# EAGLE design EnetJTAGv0a (EAGLE 5.07)
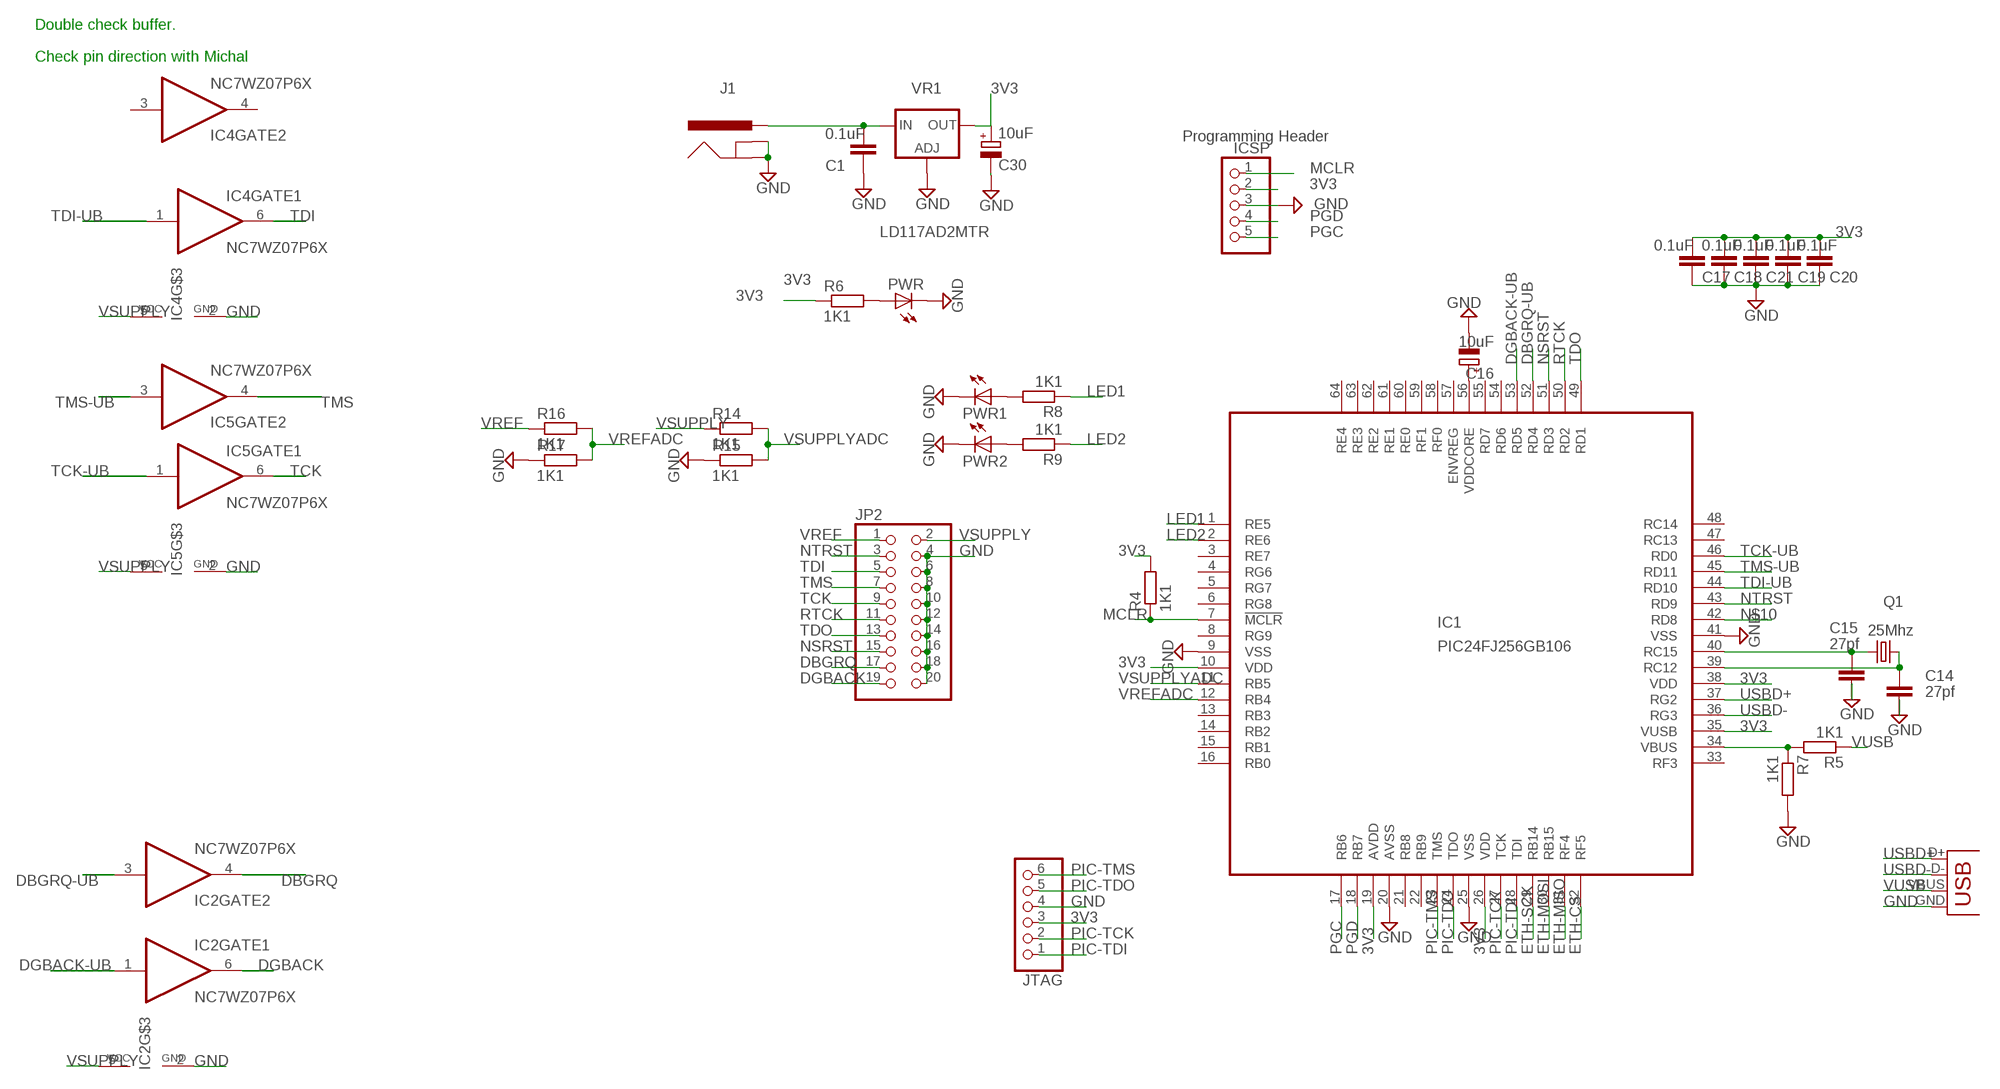
[diagram p0: schematic, sheet 1, part 1 of 2]
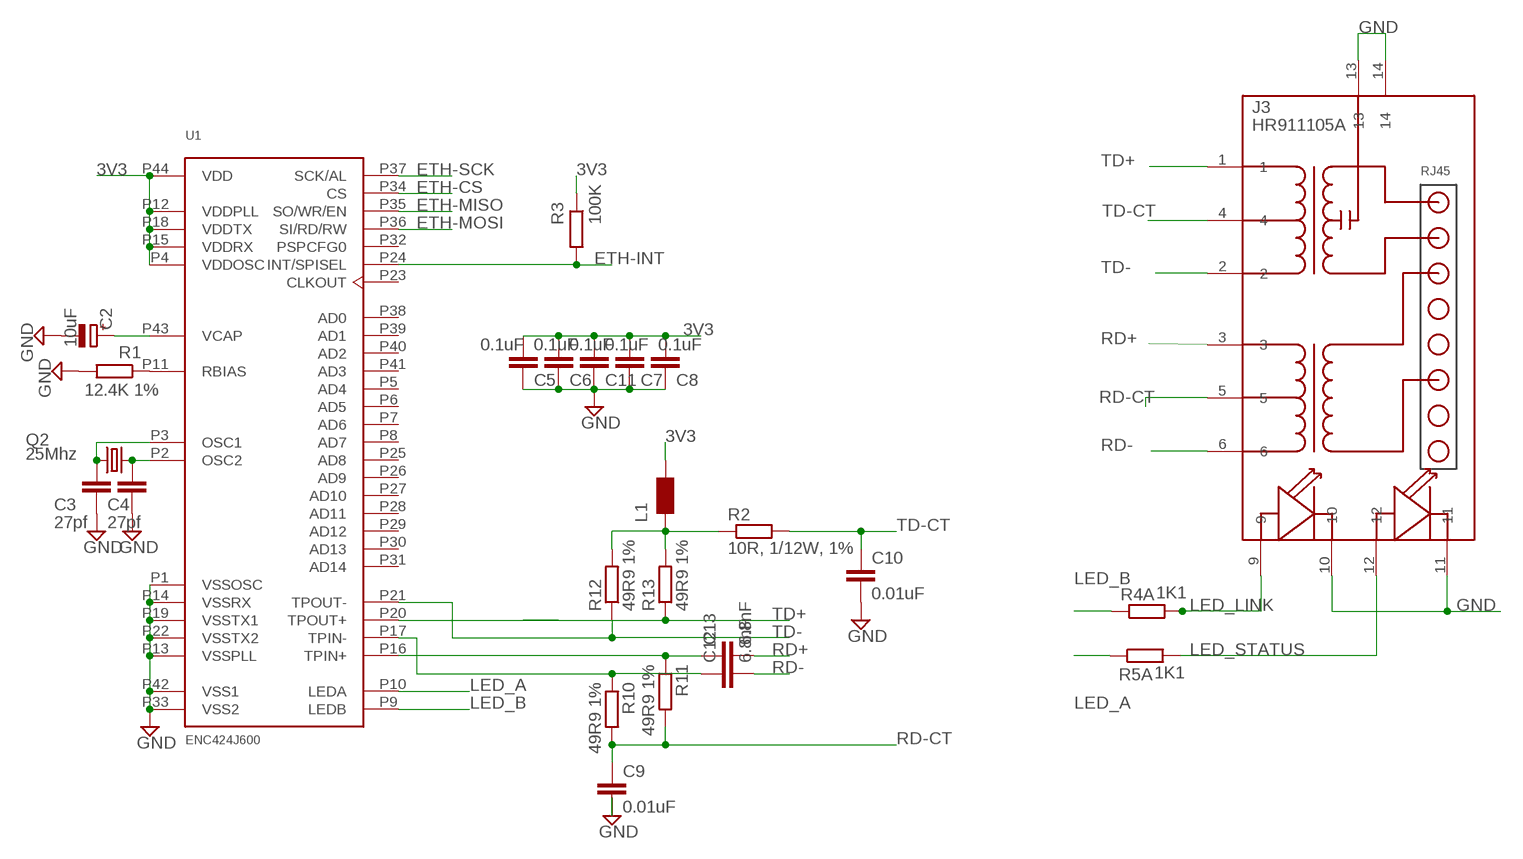
[diagram p1: schematic, sheet 1, part 2 of 2]

## Parts
C1  0.1uF  C-EUC0603  [C0603]
C2  10uF  CPOL-EUSMCA  [SMC_A]
C3  27pf  C-EUC0603  [C0603]
C4  27pf  C-EUC0603  [C0603]
C5  0.1uF  C-EUC0603  [C0603]
C6  0.1uF  C-EUC0603  [C0603]
C7  0.1uF  C-EUC0603  [C0603]
C8  0.1uF  C-EUC0603  [C0603]
C9  0.01uF  C-EUC0603  [C0603]
C10  0.01uF  C-EUC0603  [C0603]
C11  0.1uF  C-EUC0603  [C0603]
C12  6.8nF  C-EUC0603  [C0603]
C13  6.8nF  C-EUC0603  [C0603]
C14  27pf  C-EUC0603  [C0603]
C15  27pf  C-EUC0603  [C0603]
C16  10uF  CPOL-EUSMCA  [SMC_A]
C17  0.1uF  C-EUC0603  [C0603]
C18  0.1uF  C-EUC0603  [C0603]
C19  0.1uF  C-EUC0603  [C0603]
C20  0.1uF  C-EUC0603  [C0603]
C21  0.1uF  C-EUC0603  [C0603]
C30  10uF  CPOL-EUSMCA  [SMC_A]
IC1  PIC24FJ256GB106  [TQFP64-10X10]
IC2  NC7WZ07P6X  [SC70-6]
IC4  NC7WZ07P6X  [SC70-6]
IC5  NC7WZ07P6X  [SC70-6]
ICSP  PINHD-1X5  [1X05]
J1  POWER_JACKSMD  [POWER_JACK_SMD]
J3  HR911105A  [HR911105A]
JP2  PINHD-2X10  [2X10]
JTAG  PINHD-1X6  [1X06]
L1  WE-KIL_0805  [WE-KI_0805_B]
PWR  LEDCHIPLED_0603  [CHIPLED_0603]
PWR1  LEDCHIPLED_0603  [CHIPLED_0603]
PWR2  LEDCHIPLED_0603  [CHIPLED_0603]
Q1  25Mhz  CRYSTALHC49UP  [HC49UP]
Q2  25Mhz  CRYSTALHC49UP  [HC49UP]
R1  12.4K 1%  R-EU_R0603  [R0603]
R2  10R, 1/12W, 1%  R-EU_R0603  [R0603]
R3  100K  R-EU_R0603  [R0603]
R4  1K1  R-EU_R0603  [R0603]
R4A  1K1  R-EU_R0603  [R0603]
R5  1K1  R-EU_R0603  [R0603]
R5A  1K1  R-EU_R0603  [R0603]
R6  1K1  R-EU_R0603  [R0603]
R7  1K1  R-EU_R0603  [R0603]
R8  1K1  R-EU_R0603  [R0603]
R9  1K1  R-EU_R0603  [R0603]
R10  49R9 1%  R-EU_R0603  [R0603]
R11  49R9 1%  R-EU_R0603  [R0603]
R12  49R9 1%  R-EU_R0603  [R0603]
R13  49R9 1%  R-EU_R0603  [R0603]
R14  1K1  R-EU_R0603  [R0603]
R15  1K1  R-EU_R0603  [R0603]
R16  1K1  R-EU_R0603  [R0603]
R17  1K1  R-EU_R0603  [R0603]
U1  ENC424J600  [TQFP44]
VR1  LD117AD2MTR  [D2PACK]
X2  USBSMD  [USB-MINIB]

## Nets
3V3: C5.1 C6.1 C7.1 C8.1 C11.1 C17.1 C18.1 C19.1 C20.1 C21.1 C30.+ IC1.10(VDD) IC1.19(AVDD) IC1.26(VDD) IC1.35(VUSB) IC1.38(VDD) ICSP.2 JTAG.3 L1.1 R3.1 R4.2 R6.1 U1.P4(VDDOSC) U1.P12(VDDPLL) U1.P15(VDDRX) U1.P18(VDDTX) U1.P44(VDD) VR1.2(OUT)
CCT: L1.2 R2.1 R12.2 R13.2
DBGRQ: IC2.4(GATE2:O) JP2.17
DBGRQ-UB: IC1.52(RD4) IC2.3(GATE2:I)
DGBACK: IC2.6(GATE1:O) JP2.19
DGBACK-UB: IC1.53(RD5) IC2.1(GATE1:I)
DSFGDF: C12.1 R10.1 U1.P17(TPIN-)
DSGDFSG: C13.1 R11.1 U1.P16(TPIN+)
ETH-CS: IC1.32(RF5) U1.P34(CS)
ETH-INT: R3.2 U1.P24(INT/SPISEL)
ETH-MISO: IC1.31(RF4) U1.P35(SO/WR/EN)
ETH-MOSI: IC1.30(RB15) U1.P36(SI/RD/RW)
ETH-SCK: IC1.29(RB14) U1.P37(SCK/AL)
GND: C1.2 C2.- C3.2 C4.2 C5.2 C6.2 C7.2 C8.2 C9.2 C10.2 C11.2 C14.2 C15.2 C16.- C17.2 C18.2 C19.2 C20.2 C21.2 C30.- IC1.9(VSS) IC1.20(AVSS) IC1.25(VSS) IC1.41(VSS) IC2.2(GND) IC4.2(GND) IC5.2(GND) ICSP.3 J1.GND(GNDBREAK) J1.P$4(GND) J3.10 J3.11 J3.13 J3.14 JP2.4 JP2.6 JP2.8 JP2.10 JP2.12 JP2.14 JP2.16 JP2.18 JP2.20 JTAG.4 PWR1.C PWR2.C PWR.C R1.2 R7.2 R15.1 R17.1 U1.P1(VSSOSC) U1.P13(VSSPLL) U1.P14(VSSRX) U1.P19(VSSTX1) U1.P22(VSSTX2) U1.P33(VSS2) U1.P42(VSS1) VR1.1(ADJ) X2.GND
LED1: IC1.1(RE5) R8.1
LED2: IC1.2(RE6) R9.1
LED_A: R5A.1 U1.P10(LEDA)
LED_B: R4A.1 U1.P9(LEDB)
LED_LINK: J3.9 R4A.2
LED_STATUS: J3.12 R5A.2
MCLR: IC1.7(!MCLR) ICSP.1 R4.1
N$1: C2.+ U1.P43(VCAP)
N$2: R1.1 U1.P11(RBIAS)
N$3: C15.1 IC1.40(RC15) Q1.1
N$4: C3.1 Q2.1 U1.P3(OSC1)
N$5: C14.1 IC1.39(RC12) Q1.2
N$6: PWR1.A R8.2
N$7: PWR2.A R9.2
N$8: C4.1 Q2.2 U1.P2(OSC2)
N$9: C16.+ IC1.56(VDDCORE)
N$10: IC1.42(RD8)
N$11: IC1.34(VBUS) R5.2 R7.1
N$29: PWR.A R6.2
NSRST: IC1.51(RD3) JP2.15
NTRST: IC1.43(RD9) JP2.3
PGC: IC1.17(RB6) ICSP.5
PGD: IC1.18(RB7) ICSP.4
PIC-TCK: IC1.27(TCK) JTAG.2
PIC-TDI: IC1.28(TDI) JTAG.1
PIC-TDO: IC1.24(TDO) JTAG.5
PIC-TMS: IC1.23(TMS) JTAG.6
RD+: C13.2 J3.3
RD-: C12.2 J3.6
RD-CT: C9.1 J3.5 R10.2 R11.2
RTCK: IC1.50(RD2) JP2.11
TCK: IC5.6(GATE1:O) JP2.9
TCK-UB: IC1.46(RD0) IC5.1(GATE1:I)
TD+: J3.1 R13.1 U1.P20(TPOUT+)
TD-: J3.2 R12.1 U1.P21(TPOUT-)
TD-CT: C10.1 J3.4 R2.2
TDI: IC4.6(GATE1:O) JP2.5
TDI-UB: IC1.44(RD10) IC4.1(GATE1:I)
TDO: IC1.49(RD1) JP2.13
TMS: IC5.4(GATE2:O) JP2.7
TMS-UB: IC1.45(RD11) IC5.3(GATE2:I)
USBD+: IC1.37(RG2) X2.D+
USBD-: IC1.36(RG3) X2.D-
VBAT: C1.1 J1.VIN0(PWR) VR1.3(IN)
VREF: JP2.1 R16.1
VREFADC: IC1.12(RB4) R16.2 R17.2
VSUPPLY: IC2.5(VCC) IC4.5(VCC) IC5.5(VCC) JP2.2 R14.1
VSUPPLYADC: IC1.11(RB5) R14.2 R15.2
VUSB: R5.1 X2.VBUS
Unconnected: IC1.3(RE7) IC1.4(RG6) IC1.5(RG7) IC1.6(RG8) IC1.8(RG9) IC1.13(RB3) IC1.14(RB2) IC1.15(RB1) IC1.16(RB0) IC1.21(RB8) IC1.22(RB9) IC1.33(RF3) IC1.47(RC13) IC1.48(RC14) IC1.54(RD6) IC1.55(RD7) IC1.57(ENVREG) IC1.58(RF0) IC1.59(RF1) IC1.60(RE0) IC1.61(RE1) IC1.62(RE2) IC1.63(RE3) IC1.64(RE4) IC4.3(GATE2:I) IC4.4(GATE2:O) U1.P5(AD4) U1.P6(AD5) U1.P7(AD6) U1.P8(AD7) U1.P23(CLKOUT) U1.P25(AD8) U1.P26(AD9) U1.P27(AD10) U1.P28(AD11) U1.P29(AD12) U1.P30(AD13) U1.P31(AD14) U1.P32(PSPCFG0) U1.P38(AD0) U1.P39(AD1) U1.P40(AD2) U1.P41(AD3)

## Notes on the sheet
- Double check buffer.
- Check pin direction with Michal
- J1
- Programming Header

## Library data of the parts
C1 C3-C15 C17-C21 = rcl:C-EU: CAPACITOR, European symbol
C2 C16 C30 = rcl:CPOL-EU: POLARIZED CAPACITOR, European symbol
IC1 = microchip:PIC24FJ256GB106: PIC24FJ256GB106 edit this description Auto generated by make-symbol-device-package-bsdl.ulp Rev. 25 Source: PIC24FJ256GB106.bsd
IC2 IC4 IC5 = GadgetFactory:NC7WZ07P6X: Dual line drivers with 3-state outputs.
ICSP = pinhead-2:PINHD-1X5: PIN HEADER
J1 = SparkFun:POWER_JACK: Power Jack This is the standard 5.5mm barrel jack for power. The PTH is the most common, proven, reliable, footprint. All others are experimental. The Slot footprint only works if the mill layer is transmitted to the PCB fab house so be warned. Spark Fun Electronics SKU : PRT-00119. Mating wall wart : TOL-00298 (and others)
J3 = CONNECTER:HR911105A
JP2 = pinhead-2:PINHD-2X10: PIN HEADER
JTAG = pinhead-2:PINHD-1X6: PIN HEADER
L1 = wuerth-elektronik:WE-KIL: SMD Wire Wound Ceramic Inductor WE-KIL - Low profile - High Q values -- Bluetooth -- Wireless LAN -- RF oscillation circuit -- IF impedance matching
PWR PWR1 PWR2 = led:LED: LED OSRAM: - CHIPLED LG R971, LG N971, LY N971, LG Q971, LY Q971, LO R971, LY R971 LH N974, LH R974 LS Q976, LO Q976, LY Q976 LO Q996 - Hyper CHIPLED LW Q18S LB Q993, LB Q99A, LB R99A - SideLED LS A670, LO A670, LY A670, LG A670, LP A670 LB A673, LV A673, LT A673, LW A673 LH A674 LY A675 LS A676, LA A676, LO A676, LY A676, LW A676 LS A679, LY A679, LG A679 - Hyper Micro SIDELED® LS Y876, LA Y876, LO Y876, LY Y876 LT Y87S - SmartLED LW L88C, LW L88S LB L89C, LB L89S, LG L890 LS L89K, LO L89K, LY L89K LS L896, LA L896, LO L896, LY L896 - TOPLED LS T670, LO T670, LY T670, LG T670, LP T670 LSG T670, LSP T670, LSY T670, LOP T670, LYG T670 LG T671, LOG T671, LSG T671 LB T673, LV T673, LT T673, LW T673 LH T674 LS T676, LA T676, LO T676, LY T676, LB T676, LH T676, LSB T676, LW T676 LB T67C, LV T67C, LT T67C, LS T67K, LO T67K, LY T67K, LW E67C LS E67B, LA E67B, LO E67B, LY E67B, LB E67C, LV E67C, LT E67C LW T67C LS T679, LY T679, LG T679 LS T770, LO T770, LY T770, LG T770, LP T770 LB T773, LV T773, LT T773, LW T773 LH T774 LS E675, LA E675, LY E675, LS T675 LS T776, LA T776, LO T776, LY T776, LB T776 LHGB T686 LT T68C, LB T68C - Hyper Mini TOPLED® LB M676 - Mini TOPLED Santana® LG M470 LS M47K, LO M47K, LY M47K Source: http://www.osram.convergy.de LUXEON: - LUMILED® LXK2-PW12-R00, LXK2-PW12-S00, LXK2-PW14-U00, LXK2-PW14-V00 LXK2-PM12-R00, LXK2-PM12-S00, LXK2-PM14-U00 LXK2-PE12-Q00, LXK2-PE12-R00, LXK2-PE12-S00, LXK2-PE14-T00, LXK2-PE14-U00 LXK2-PB12-K00, LXK2-PB12-L00, LXK2-PB12-M00, LXK2-PB14-N00, LXK2-PB14-P00, LXK2-PB14-Q00 LXK2-PR12-L00, LXK2-PR12-M00, LXK2-PR14-Q00, LXK2-PR14-R00 LXK2-PD12-Q00, LXK2-PD12-R00, LXK2-PD12-S00 LXK2-PH12-R00, LXK2-PH12-S00 LXK2-PL12-P00, LXK2-PL12-Q00, LXK2-PL12-R00 Source: www.luxeon.com KINGBRIGHT: KA-3528ASYC Source: www.kingbright.com
Q1 Q2 = crystal:CRYSTAL: CRYSTAL
R1-R4 R4A R5 R5A R6-R17 = rcl:R-EU_: RESISTOR, European symbol
U1 = dp_devices:ENC424J600: Stand-Alone 10/100 Ethernet Controller with SPI or Parallel Interface Source: http://ww1.microchip.com/downloads/en/DeviceDoc/39935c.pdf
VR1 = v-reg:LD117A?*: Low drop fixed and adjustable positive voltage regulators 1 A Source: http://www.st.com/stonline/products/literature/ds/7194/ld1117axx.pdf
X2 = SparkFun:USB: USB Connectors USB-B-PTH is fully proven SKU : PRT-00139 USB-miniB is fully proven SKU : PRT-00587 USB-A-PCB is untested. USB-A-H is throughly reviewed, but untested. Spark Fun Electronics SKU : PRT-00437 USB-B-SMT is throughly reviewed, but untested. Needs silkscreen touching up. USB-A-S has not been used/tested USB-MB-H has not been used/tested

## Board
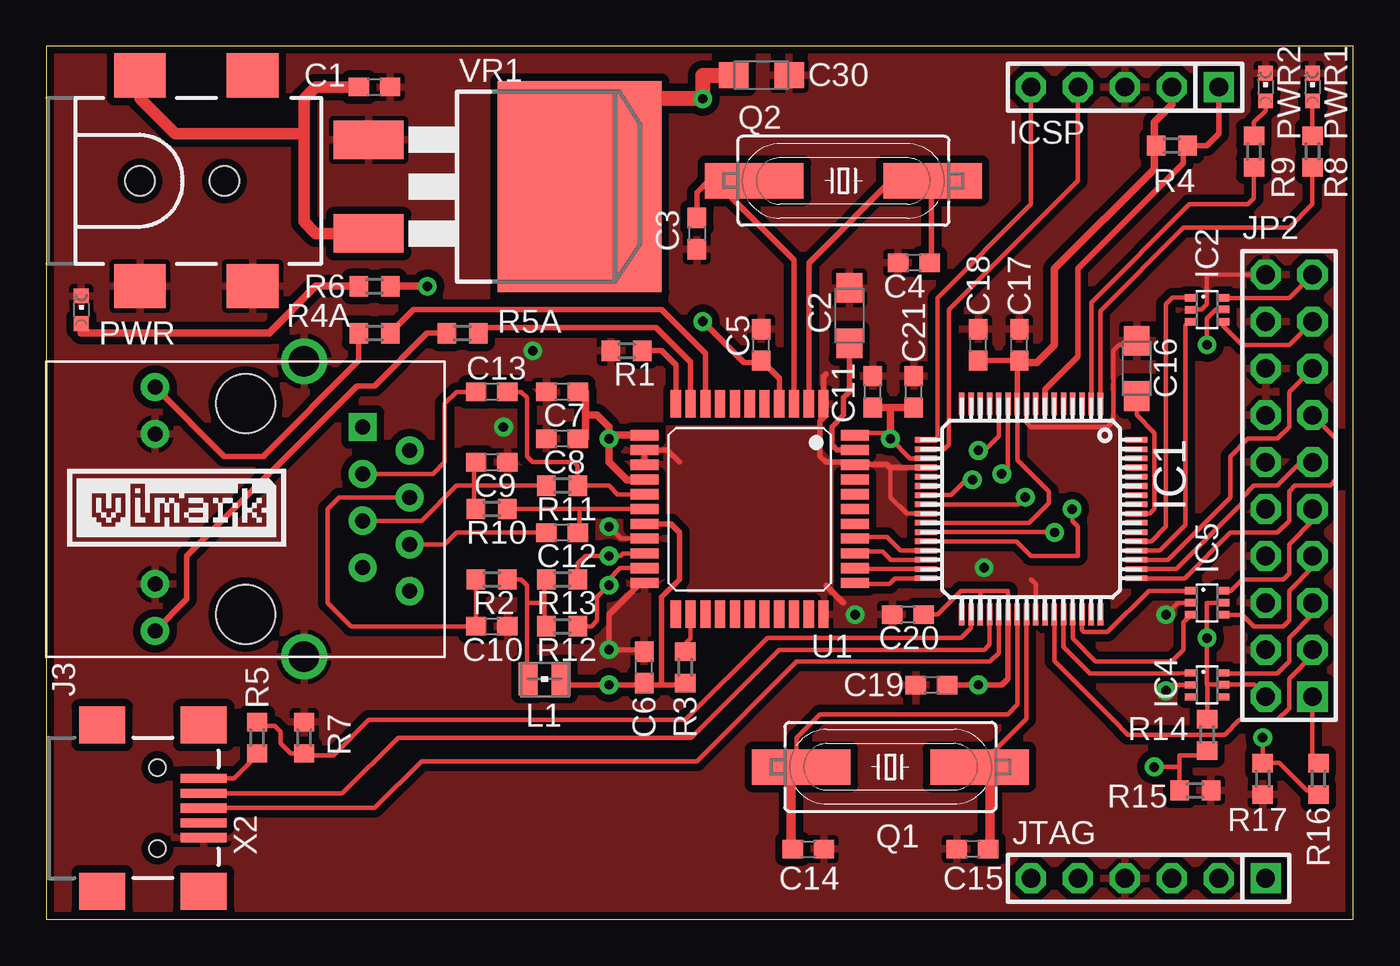
[diagram p2: board, top side]
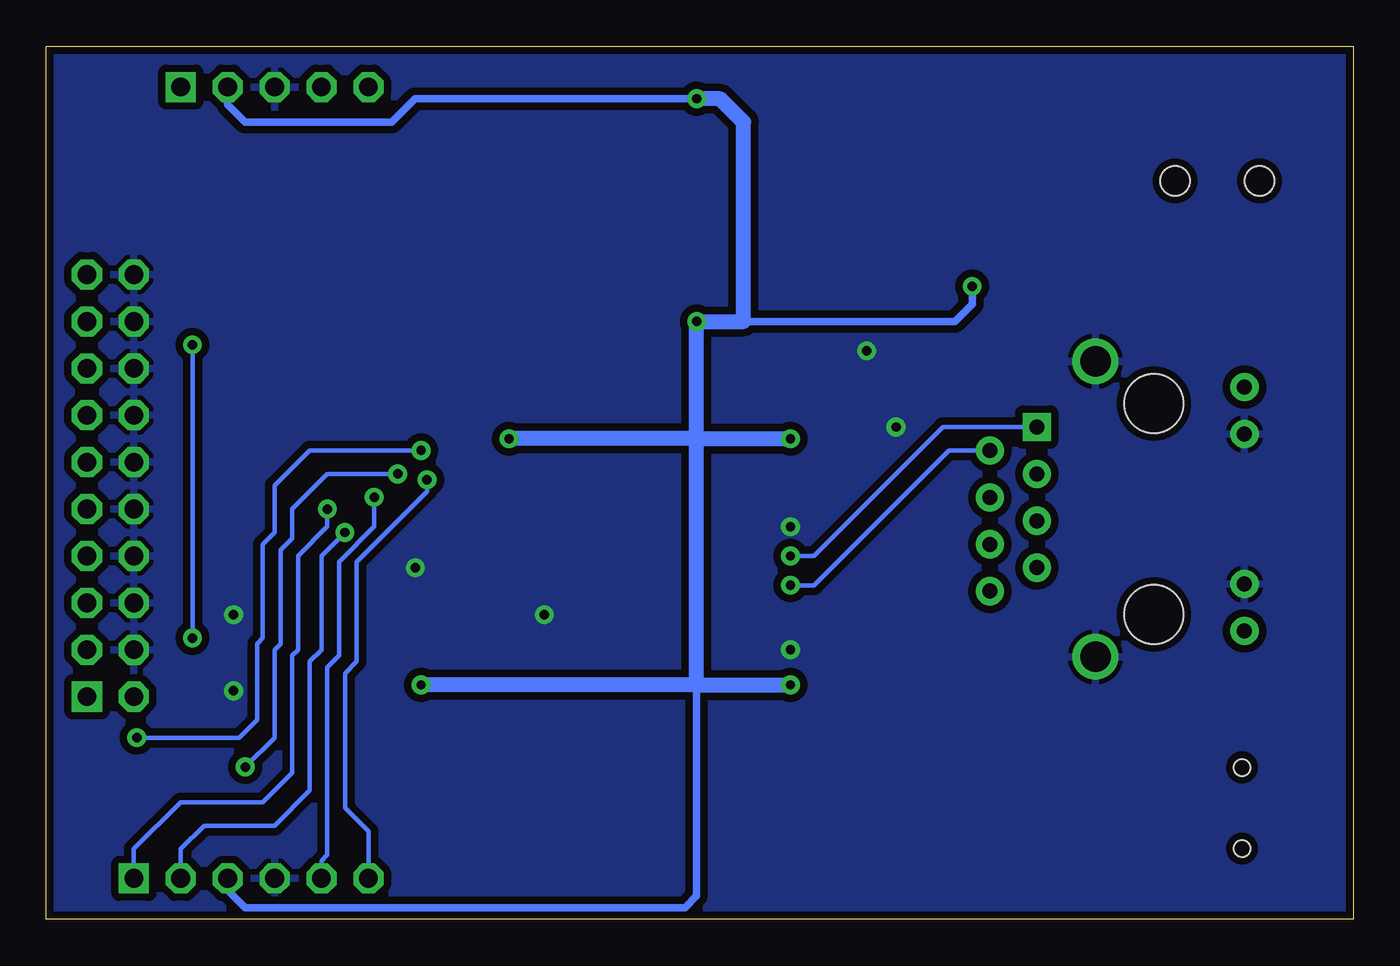
[diagram p3: board, bottom side, seen from below]

Size 70.79 x 47.3 mm. Coordinates in mm from the lower left corner, seen from the top.
Outline: 0,0 70.79,0 70.79,47.3 0,47.3 0,0
Copper layers (1*16): Top 0.035mm / dielectric 1.5mm / Bottom 0.035mm
Design rules "SparkFun": minimum track width 8mil, minimum drill 20mil, track to track 8mil, track to pad 8mil, pad to pad 8mil, via to via 8mil, smd to smd 8mil, copper to edge 10mil, drill to drill 8mil, minimum pad ring 12mil, minimum via ring 10mil, stop-mask expansion 4mil, vias tented up to drill 25mil, thermal gap 10mil

### Footprints (pad centres in the part's own frame; a part is rotated, then mirrored left to right if it is on the bottom)
C0603 = smd 1.1 x 1: 1 -0.85,0; 2 0.85,0
SMC_A = smd 1.6 x 1.4: + -1.5,0; - 1.5,0
TQFP64-10X10 = smd 1.2 x 0.3: 1 -5.7,3.75; 2 -5.7,3.25; 3 -5.7,2.75; 4 -5.7,2.25; 5 -5.7,1.75; 6 -5.7,1.25; 7 -5.7,0.75; 8 -5.7,0.25; 9 -5.7,-0.25; 10 -5.7,-0.75; 11 -5.7,-1.25; 12 -5.7,-1.75; 13 -5.7,-2.25; 14 -5.7,-2.75; 15 -5.7,-3.25; 16 -5.7,-3.75; 33 5.7,-3.75; 34 5.7,-3.25; 35 5.7,-2.75; 36 5.7,-2.25; 37 5.7,-1.75; 38 5.7,-1.25; 39 5.7,-0.75; 40 5.7,-0.25; 41 5.7,0.25; 42 5.7,0.75; 43 5.7,1.25; 44 5.7,1.75; 45 5.7,2.25; 46 5.7,2.75; 47 5.7,3.25; 48 5.7,3.75 | smd 0.3 x 1.2: 17 -3.75,-5.7; 18 -3.25,-5.7; 19 -2.75,-5.7; 20 -2.25,-5.7; 21 -1.75,-5.7; 22 -1.25,-5.7; 23 -0.75,-5.7; 24 -0.25,-5.7; 25 0.25,-5.7; 26 0.75,-5.7; 27 1.25,-5.7; 28 1.75,-5.7; 29 2.25,-5.7; 30 2.75,-5.7; 31 3.25,-5.7; 32 3.75,-5.7; 49 3.75,5.7; 50 3.25,5.7; 51 2.75,5.7; 52 2.25,5.7; 53 1.75,5.7; 54 1.25,5.7; 55 0.75,5.7; 56 0.25,5.7; 57 -0.25,5.7; 58 -0.75,5.7; 59 -1.25,5.7; 60 -1.75,5.7; 61 -2.25,5.7; 62 -2.75,5.7; 63 -3.25,5.7; 64 -3.75,5.7
SC70-6 = smd 0.4 x 0.7: 1 -0.65,-0.85; 2 0,-0.85; 3 0.65,-0.85; 4 0.65,0.85; 5 -0.015,0.85; 6 -0.65,0.85
1X05 = drill 1.016 square: 1 -5.08,0 | drill 1.016 octagon: 2 -2.54,0; 3 0,0; 4 2.54,0; 5 5.08,0
POWER_JACK_SMD = smd 2.8 x 2.4: GND 0,-5.7; P$4 6.1,-5.7; VIN0 0,5.7; VIN1 6.1,5.7 | hole 1.6: 0,0; 4.572,0
HR911105A = drill 0.813 pad 1.524 square: 1 4.445,-6.35 | drill 0.813 pad 1.524 round: 2 3.175,-8.89; 3 1.905,-6.35; 4 0.635,-8.89; 5 -0.635,-6.35; 6 -1.905,-8.89; 7 -3.175,-6.35; 8 -4.445,-8.89; 9 6.604,4.902; 10 4.064,4.902; 11 -4.064,4.902; 12 -6.604,4.902 | drill 1.651 pad 2.159 round: 13 8.001,-3.175; 14 -8.001,-3.175 | hole 3.2: 5.715,0; -5.715,0
2X10 = drill 1.016 square: 1 -11.43,-1.27 | drill 1.016 octagon: 2 -11.43,1.27; 3 -8.89,-1.27; 4 -8.89,1.27; 5 -6.35,-1.27; 6 -6.35,1.27; 7 -3.81,-1.27; 8 -3.81,1.27; 9 -1.27,-1.27; 10 -1.27,1.27; 11 1.27,-1.27; 12 1.27,1.27; 13 3.81,-1.27; 14 3.81,1.27; 15 6.35,-1.27; 16 6.35,1.27; 17 8.89,-1.27; 18 8.89,1.27; 19 11.43,-1.27; 20 11.43,1.27
1X06 = drill 1.016 square: 1 -6.35,0 | drill 1.016 octagon: 2 -3.81,0; 3 -1.27,0; 4 1.27,0; 5 3.81,0; 6 6.35,0
WE-KI_0805_B = smd 1.02 x 1.78: 1 -0.89,0; 2 0.89,0
CHIPLED_0603 = smd 0.8 x 0.8: A 0,-0.75; C 0,0.75
HC49UP = smd 5.334 x 1.93: 1 -4.826,0; 2 4.826,0
R0603 = smd 1 x 1.1: 1 -0.85,0; 2 0.85,0
TQFP44 = smd 0.55 x 1.5: P1 -4,-5.7; P2 -3.2,-5.7; P3 -2.4,-5.7; P4 -1.6,-5.7; P5 -0.8,-5.7; P6 0,-5.7; P7 0.8,-5.7; P8 1.6,-5.7; P9 2.4,-5.7; P10 3.2,-5.7; P11 4,-5.7; P23 4,5.7; P24 3.2,5.7; P25 2.4,5.7; P26 1.6,5.7; P27 0.8,5.7; P28 0,5.7; P29 -0.8,5.7; P30 -1.6,5.7; P31 -2.4,5.7; P32 -3.2,5.7; P33 -4,5.7 | smd 1.5 x 0.55: P12 5.7,-4; P13 5.7,-3.2; P14 5.7,-2.4; P15 5.7,-1.6; P16 5.7,-0.8; P17 5.7,0; P18 5.7,0.8; P19 5.7,1.6; P20 5.7,2.4; P21 5.7,3.2; P22 5.7,4; P34 -5.7,4; P35 -5.7,3.2; P36 -5.7,2.4; P37 -5.7,1.6; P38 -5.7,0.8; P39 -5.7,0; P40 -5.7,-0.8; P41 -5.7,-1.6; P42 -5.7,-2.4; P43 -5.7,-3.2; P44 -5.7,-4
D2PACK = smd 2.083 x 3.81: 1 -2.54,-8.89; 3 2.54,-8.89 | smd 11.43 x 8.89: 2 0,2.54
USB-MINIB = smd 2.5 x 0.5: D+ 2.5,0; D- 2.5,0.8; GND 2.5,-1.6; ID 2.5,-0.8; VBUS 2.5,1.6 | smd 2.5 x 2: GND@1 -3,-4.5; GND@2 -3,4.5; GND@3 2.5,4.5; GND@4 2.5,-4.5 | hole 0.9: 0,2.2; 0,-2.2

### Placement (x,y rotation side)
C1  17.78,45.09 0 top
C2  43.5,32.7 90 top
C3  35.24,37.15 270 top
C4  46.99,35.56 180 top
C5  38.73,31.11 90 top
C6  32.38,13.65 90 top
C7  27.94,28.57 180 top
C8  27.94,26.04 180 top
C9  24.13,24.77 0 top
C10  24.13,15.88 0 top
C11  44.77,28.57 90 top
C12  27.94,20.95 180 top
C13  24.13,28.57 180 top
C14  41.27,3.81 0 top
C15  50.16,3.81 180 top
C16  59.05,29.84 90 top
C17  52.7,31.11 90 top
C18  50.48,31.11 90 top
C19  47.94,12.7 180 top
C20  46.67,16.51 180 top
C21  46.99,28.57 90 top
C30  38.73,45.72 0 top
IC1  53.34,22.23 270 top
IC2  62.87,33.02 270 top
IC4  62.87,12.7 270 top
IC5  62.87,17.14 270 top
ICSP  58.42,45.09 180 top
J1  5.08,40.01 0 top
J3  10.79,22.23 90 top
JP2  67.31,23.5 90 top
JTAG  59.69,2.22 180 top
L1  26.99,13.02 180 top
PWR  1.91,33.02 0 top
PWR1  68.58,45.09 0 top
PWR2  66.04,45.09 0 top
Q1  45.72,8.26 180 top
Q2  43.18,40.01 0 top
R1  31.43,30.8 180 top
R2  24.13,18.41 180 top
R3  34.61,13.65 90 top
R4  60.96,41.91 180 top
R4A  17.78,31.75 180 top
R5  11.43,9.84 90 top
R5A  22.54,31.75 180 top
R6  17.78,34.29 180 top
R7  13.97,9.84 90 top
R8  68.58,41.59 90 top
R9  65.41,41.59 90 top
R10  24.13,22.23 180 top
R11  27.94,23.5 180 top
R12  27.94,15.88 180 top
R13  27.94,18.41 180 top
R14  62.87,10 270 top
R15  62.23,6.99 180 top
R16  68.9,7.62 270 top
R17  65.88,7.62 90 top
U1  38.1,22.23 180 top
U$1  [VIMARK_LOGO]  1.27,20.32 0 top
VR1  26.35,39.69 270 top
X2  6.03,6.03 0 top

### Tracks (layer width: path | path; a pad name or v marks a point on that pad's centre or on a via)
3V3  (via drill 0.51)
  Top 0.254: U1.P12 32.39,26.24 | 32.41,21.41 U1.P18 | 29.21,26.04 C8.1 | v30.48,26.04 30.67,26.23 | 32.38,23.8 U1.P15 | C17.1 52.59,30.15 | IC1.19 46.78,24.98 v45.72,26.04 45.4,26.35 44.45,26.35 | IC1.26 53.23,21.48 54.29,22.54 54.29,23.18 52.59,24.88 IC1.10 | IC1.38 52.07,17.78 50.59,17.78 | 50.59,17.78 IC1.35 | 50.59,17.78 49.53,17.78 48.26,16.51 C20.1
  Top 0.305: R3.1 34.82,12.8 34.61,13.02 34.61,12.7 33.34,12.7 | 52.59,30.15 IC1.10 | U1.P4 39.7,29.3 C5.1 38.63,30.16 37.78,30.16 v35.56,32.38 | U1.P44 44.32,26.23 44.45,26.35 | 32.41,21.41 33.83,21.41 34.29,20.95 34.29,18.41 33.34,17.46 33.34,12.7 | L1.1 27.94,12.7 v30.48,12.7 32.38,12.7 | 32.38,12.7 33.34,12.7 | U1.P12 32.28,26.34 | 29.21,28.57 C7.1 | IC1.38 52.09,13.04 51.75,12.7 v50.48,12.7 C19.1 | C17.1 C18.1 | 32.38,12.7 C6.1
  Top 0.406: 29.21,27.3 29.84,27.3 30.48,26.67 v30.48,26.04 30.48,24.77 31.45,23.8 32.38,23.8 | 29.21,27.3 29.21,26.04 | 30.67,26.23 U1.P12 | 52.81,30.16 53.66,30.16 54.61,31.11 54.61,35.24 60.01,40.64 60.01,41.81 | ICSP.2 60.96,44.13 60.01,43.18 60.01,42.01 | 29.21,27.3 29.21,28.57 | v20.64,34.29 R6.1 | 45.72,27.73 C11.1 | 45.72,27.73 C21.1 | v45.72,26.04 45.72,27.73
  Top 0.61: 52.81,30.16 C17.1 | VR1.2 25.4,40.23 | 60.01,41.81 R4.2 60.01,42.01
  Top 0.813: C30.+ 35.56,45.72 v35.56,44.45 29.21,44.45 | 29.21,44.45 25.72,44.45 25.4,44.13 25.4,40.23 | VR1.2 28.89,44.13 29.21,44.45
  Bottom 0.406: 33.02,32.38 21.59,32.38 20.64,33.34 v20.64,34.29 | JTAG.3 60.96,1.59 60.01,0.64 36.2,0.64 35.56,1.27 35.56,12.7 | ICSP.2 60.96,44.13 60.01,43.18 52.07,43.18 50.8,44.45 v35.56,44.45
  Bottom 0.813: v35.56,44.45 34.29,44.45 33.02,43.18 33.02,32.38 v35.56,32.38 35.56,26.04 | 35.56,26.04 v45.72,26.04 | 35.56,12.7 35.56,26.04 | 35.56,12.7 v50.48,12.7 | 35.56,26.04 v30.48,26.04 | 35.56,12.7 v30.48,12.7
CCT
  Top 0.254: R2.1 25.72,18.41 26.04,18.1 26.04,17.14 | 26.99,15.88 R12.2 26.99,15.98 26.99,17.14 | R13.2 26.99,18.41 26.99,17.14 | 26.04,17.14 26.04,13.08 L1.2 | 26.04,17.14 26.99,17.14
DBGRQ
  Top 0.254: JP2.17 67.31,31.11 64.77,31.11 63.72,32.17 IC2.4
DBGRQ-UB
  Top 0.254: IC1.52 60.3,19.98 61.7,21.38 61.7,32.17 61.91,32.38 IC2.3
DGBACK
  Top 0.254: JP2.19 67.31,33.66 63.73,33.66 IC2.6
DGBACK-UB
  Top 0.254: IC2.1 60.98,33.67 60.64,33.34 60.64,21.27 59.84,20.48 IC1.53
DSFGDF
  Top 0.254: R10.1 28.89,22.23 | 28.89,22.23 U1.P17 | 28.89,22.23 28.89,21.06 C12.1
DSGDFSG
  Top 0.254: U1.P16 30.95,23.02 30.48,23.5 R11.1 28.79,24.55 28.57,24.77 26.35,24.77 26.04,25.08 26.04,28.26 25.72,28.57 C13.1
ETH-CS
  Top 0.254: IC1.32 45.97,18.48 45.66,18.16 43.86,18.16 U1.P34
ETH-INT
  Top 0.254: U1.P24 34.9,15.21 34.29,14.61 R3.2
ETH-MISO
  Top 0.254: IC1.31 43.85,18.98 U1.P35
ETH-MOSI
  Top 0.254: IC1.30 45.74,19.48 45.28,19.94 43.91,19.94 U1.P36
ETH-SCK
  Top 0.254: IC1.29 46.26,19.98 45.53,20.7 43.88,20.7 U1.P37
GND  (via drill 0.51)
  Top 0.254: U1.P19 31.13,20.62 v30.48,21.27 | IC1.41 53.59,18.16 53.34,18.41 | IC1.9 53.09,26.92 53.34,26.67 57.47,26.67 57.78,26.99 57.78,30.8 58.1,31.11 58.83,31.11 C16.- | IC2.2 62.55,33.02 62.87,33.34 62.87,34.92 JP2.20 | IC5.2 61.28,17.14 v60.64,16.51 | IC4.2 60.96,12.7 v60.64,12.38 | IC1.25 46.6,21.98 45.72,22.86 45.72,24.45
  Top 0.305: 42.23,29.53 42.1,29.4 U1.P1 42.23,27.8 42.23,27.3 41.91,26.99 41.91,25.08 42.23,24.77 44.45,24.77 44.59,24.62 | IC1.20 45.75,24.48 45.72,24.45 45.54,24.62 44.59,24.62 | 44.59,24.62 U1.P42 | 43.18,17.14 42.23,18.1 | 34.29,24.77 33.63,25.43 U1.P13 32.4,24.78 32.38,24.77 | U1.P22 32.2,18.23 30.5,16.52 30.5,14.94 v30.48,14.61 32.28,14.61 C6.2
  other vias: 43.81,16.51 24.77,26.67 26.35,30.8 50.8,19.05
  pour Top (isolate 0.406): 0,47.31 71.12,47.31 71.12,0 0,0
  pour Bottom (isolate 0.406): 0,47.31 71.12,47.31 71.12,0 0,0
LED1
  Top 0.254: IC1.1 57.09,32.96 61.59,37.47 67.31,37.47 68.58,38.73 R8.1
LED2
  Top 0.254: IC1.2 56.59,33.41 61.91,38.73 65.09,38.73 65.41,39.05 R9.1
LED_A
  Top 0.305: U1.P10 34.9,30.19 33.02,32.07 23.71,32.07 R5A.1
LED_B
  Top 0.305: U1.P9 35.7,30.66 33.34,33.02 19.9,33.02 R4A.1
LED_LINK
  Top 0.305: R4A.2 16.93,30.27 11.75,25.08 9.64,25.08 J3.9
LED_STATUS
  Top 0.305: R5A.2 20.64,31.75 17.78,28.89 16.83,28.89 7.62,19.68 7.62,17.35 J3.12
MCLR
  Top 0.305: IC1.7 54.09,28.69 55.88,30.48 55.88,35.24 61.59,40.96 61.59,41.7 R4.1 62.87,41.91 63.5,42.55 ICSP.1
N$1
  Top 0.305: U1.P43 42.84,25.43 42.55,25.72 42.55,26.67 43.18,27.3 43.18,28.26 43.5,28.57 C2.+
N$2
  Top 0.305: U1.P11 34.1,30.04 33.34,30.8 R1.1
N$3
  Top 0.254: Q1.1 49.28,8.89 | IC1.40 53.09,10.86 51.12,8.89 51.12,8.26
  Top 0.508: C15.1 51.12,3.81 51.12,8.26 Q1.1
N$4
  Top 0.305: 36.83,40.01 35.88,40.01 35.24,39.37 C3.1 | 36.83,40.01 Q2.1 | U1.P3 40.5,35.7 36.83,39.37 36.83,40.01
N$5
  Top 0.254: Q1.2 40.58,8.57 40.64,8.57 40.64,9.84 41.91,11.11 52.07,11.11 52.59,11.63 IC1.39
  Top 0.508: C14.1 40.32,3.81 40.32,8.26 Q1.2
N$6
  Top 0.254: R8.2 PWR1.A
N$7
  Top 0.254: PWR2.A 66.04,43.81 65.41,43.18 R9.2
N$8
  Top 0.305: 47.84,35.46 C4.1 47.94,35.66 47.94,39.94 Q2.2 | U1.P2 41.3,35.56 46.1,40.36
  Top 0.406: 45.72,40.32 45.72,40.44 46.1,40.36 Q2.2 | U1.P2
N$9
  Top 0.254: IC1.56 59.76,21.98 60.01,22.23 60.01,26.35 59.05,27.3 C16.+
N$11
  Top 0.254: IC1.34 50.09,15.8 49.53,15.24 39.05,15.24 34.61,10.79 17.46,10.79 15.56,8.89 14.07,8.89 R7.1 13.23,8.99 12.7,9.53 12.7,10.16 12.38,10.48 11.64,10.48 R5.2 11.64,10.69 11.75,10.79
N$29
  Top 0.406: R6.2 14.61,34.29 12.06,31.75 1.91,31.75 PWR.A
NSRST
  Top 0.254: IC1.51 60.75,19.48 64.14,22.86 64.14,25.08 65.09,26.04 66.67,26.04 67.31,26.67 67.31,28.57 JP2.15
NTRST
  Top 0.254: JP2.3 68.58,14.29 67.31,13.02 67.31,11.43 66.67,10.79 64.61,10.79 63.82,10 58.58,10 57.78,10.79 54.59,13.99 IC1.43
PGC
  Top 0.254: ICSP.5 53.34,38.73 48.26,33.66 48.26,26.04 48.2,25.98 IC1.17
PGD
  Top 0.254: ICSP.4 55.88,40.01 48.9,33.02 48.9,25.72 48.65,25.48 IC1.18
PIC-TCK  (via drill 0.51)
  Top 0.254: IC1.27 54.59,20.98 v54.61,20.95
  Bottom 0.254: v54.61,20.95 55.88,19.68 55.88,14.61 56.52,13.97 56.52,6.99 58.42,5.08 62.23,5.08 63.5,3.81 JTAG.2
PIC-TDI  (via drill 0.51)
  Top 0.254: IC1.28 52.55,20.48 53.34,19.68 55.88,19.68 55.88,21.27 55.56,21.59 v55.56,22.23
  Bottom 0.254: JTAG.1 66.04,3.81 63.5,6.35 59.05,6.35 57.47,7.94 57.47,14.29 57.15,14.61 57.15,19.68 55.56,21.27 v55.56,22.23
PIC-TDO  (via drill 0.51)
  Top 0.254: IC1.24 52.64,22.48 v53.02,22.86
  Bottom 0.254: v53.02,22.86 53.02,21.27 54.93,19.37 54.93,14.29 55.56,13.65 55.56,3.49 55.88,3.17 JTAG.5
PIC-TMS  (via drill 0.51)
  Top 0.254: IC1.23 49.01,22.98 49.85,23.81 v50.16,23.81
  Bottom 0.254: v50.16,23.81 50.16,23.18 53.98,19.37 53.98,13.97 54.61,13.34 54.61,6.03 53.34,4.76 JTAG.6
RD+
  Top 0.254: J3.3 20.95,24.13 21.59,24.77 21.59,27.94 22.23,28.57 C13.2
RD-
  Top 0.254: C12.2 22.23,20.95 21.59,20.32 J3.6
RD-CT
  Top 0.254: J3.5 20.32,21.59 22.23,23.5 23.18,23.5 | 23.18,23.5 R11.2 | C9.1 23.18,24.77 23.18,23.5 | R10.2 23.18,22.23 23.18,23.5
RTCK
  Top 0.254: IC1.50 61.2,18.98 64.77,22.54 64.77,22.86 65.41,23.5 66.67,23.5 67.94,24.77 JP2.11
TCK
  Top 0.254: IC5.6 64.15,17.8 64.77,18.41 66.99,18.41 67.31,18.73 67.31,20.32 68.58,21.59 JP2.9
TCK-UB
  Top 0.254: IC1.46 56.09,15.66 56.2,15.56 57.47,15.56 59.7,17.8 IC5.1
TD+  (via drill 0.51)
  Top 0.254: U1.P20 32.39,19.81 31.24,19.81 31.11,19.68 v30.48,19.68 29.21,19.68 28.79,19.27 R13.1
  Bottom 0.254: J3.1 22.23,26.67 29.21,19.68 v30.48,19.68
TD-  (via drill 0.51)
  Top 0.254: U1.P21 | U1.P21 31.09,19.02 30.48,18.41 v30.48,18.1 29.84,17.46 29.84,16.19 29.53,15.88 R12.1
  Bottom 0.254: J3.2 21.91,25.4 29.21,18.1 v30.48,18.1
TD-CT
  Top 0.254: R2.2 C10.1 16.51,15.88 15.24,17.14 15.24,22.23 15.88,22.86 J3.4
TDI
  Top 0.254: JP2.5 68.58,16.51 67.31,15.24 67.31,13.97 66.67,13.34 63.7,13.34 IC4.6
TDI-UB
  Top 0.254: IC1.44 55.09,14.76 56.52,13.34 61.37,13.34 IC4.1
TDO
  Top 0.254: IC1.49 61.66,18.48 64.14,20.95 66.67,20.95 67.31,21.59 67.31,23.18 67.63,23.5 69.53,23.5 69.85,23.81 69.85,26.04 JP2.13
TMS
  Top 0.254: IC5.4 64.78,16.5 65.41,15.88 66.99,15.88 67.31,16.19 67.31,17.78 68.58,19.05 JP2.7
TMS-UB
  Top 0.254: IC1.45 55.59,15.21 56.83,13.97 60.96,13.97 61.59,14.61 61.59,16.07 IC5.3
USBD+
  Top 0.254: X2.D+ 17.78,6.03 20.32,8.57 35.24,8.57 40.64,13.97 51.12,13.97 51.59,14.44 IC1.37
USBD-
  Top 0.254: X2.D- 16.04,6.83 19.05,9.84 34.92,9.84 39.69,14.61 50.8,14.61 51.09,14.89 IC1.36
VBAT
  Top 0.61: 5.08,46.35 J1.VIN0 5.08,44.45 6.99,42.55 13.97,42.55 | VR1.3 14.61,37.15 13.97,37.78 13.97,42.55 | C1.1 14.61,45.09 13.97,44.45 13.97,42.55
VREF
  Top 0.254: JP2.1 68.58,8.79 R16.1
VREFADC  (via drill 0.51)
  Top 0.254: 51.61,27.9 IC1.12 51.59,26.19 50.8,25.4 v50.48,25.4 | 68.58,6.99 68.8,6.77 R16.2 68.9,6.99 68.26,6.99 66.78,8.47 R17.2 v65.88,9.84 | v65.88,9.84
  Bottom 0.254: v65.88,9.84 60.33,9.84 59.37,10.79 59.37,14.92 59.05,15.24 59.05,20.32 58.42,20.95 58.42,23.5 56.52,25.4 v50.48,25.4
VSUPPLY  (via drill 0.51)
  Top 0.254: 62.88,12.71 IC4.5 65.39,12.71 JP2.2 | 62.88,12.71 62.87,12.7 v62.87,15.24 62.87,17.14 63.7,17.14 IC5.5 | 62.88,12.71 62.88,11.31 R14.1 | v62.87,31.11 62.87,32.54 63.34,33.02 63.7,33.02 IC2.5
  Bottom 0.254: v62.87,15.24 v62.87,31.11
VSUPPLYADC  (via drill 0.51)
  Top 0.254: R15.2 61.38,8.26 | 61.38,8.26 61.38,8.89 62.87,8.89 R14.2 | 61.38,8.26 v60.01,8.26 | IC1.11 52.09,24.47 v51.75,24.13
  Bottom 0.254: v60.01,8.26 58.42,9.84 58.42,14.61 58.1,14.92 58.1,20 57.47,20.64 57.47,22.23 55.56,24.13 v51.75,24.13
VUSB
  Top 0.254: X2.VBUS 10.17,7.63 11.11,8.57 R5.1